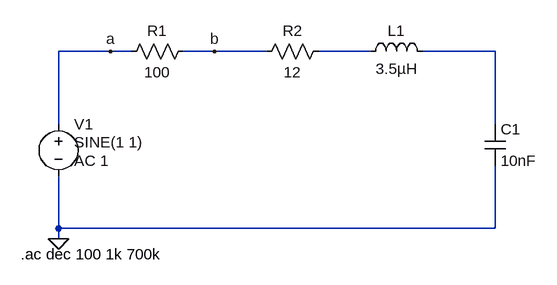
[diagram p0: schematic SeriesInductance.asc]
SeriesInductance.asc, the LTspice schematic file:
Version 4
SHEET 1 880 680
WIRE -576 -432 -656 -432
WIRE -544 -432 -576 -432
WIRE -416 -432 -464 -432
WIRE -336 -432 -416 -432
WIRE -176 -432 -256 -432
WIRE 16 -432 -96 -432
WIRE -656 -320 -656 -432
WIRE 16 -320 16 -432
WIRE -656 -160 -656 -240
WIRE 16 -160 16 -256
WIRE 16 -160 -656 -160
WIRE -656 -144 -656 -160
FLAG -656 -144 0
FLAG -576 -432 a
FLAG -416 -432 b
SYMBOL res -448 -448 R90
WINDOW 0 0 56 VBottom 2
WINDOW 3 32 56 VTop 2
SYMATTR InstName R1
SYMATTR Value 100
SYMBOL res -240 -448 R90
WINDOW 0 0 56 VBottom 2
WINDOW 3 32 56 VTop 2
SYMATTR InstName R2
SYMATTR Value 12
SYMBOL ind -192 -416 R270
WINDOW 0 32 56 VTop 2
WINDOW 3 5 56 VBottom 2
SYMATTR InstName L1
SYMATTR Value 3.5µH
SYMBOL cap 0 -320 R0
SYMATTR InstName C1
SYMATTR Value 10nF
SYMBOL LTspice_EuroComponents\\voltage -656 -336 R0
WINDOW 3 24 44 Left 2
WINDOW 123 24 72 Left 2
WINDOW 39 0 0 Left 0
SYMATTR InstName V1
SYMATTR Value SINE(1 1)
SYMATTR Value2 AC 1
TEXT -714 -120 Left 2 !.ac dec 100 1k 700k

The netlist it stands for:
* SeriesInductance.asc
R1 b a 100
R2 N001 b 12
L1 N001 N002 3.5µH
C1 N002 0 10nF
V1 a 0 SINE(1 1) AC 1
.ac dec 100 1k 700k
.backanno
.end